# EAGLE schematic Serial I2C Bridge Prop (EAGLE 6.1)
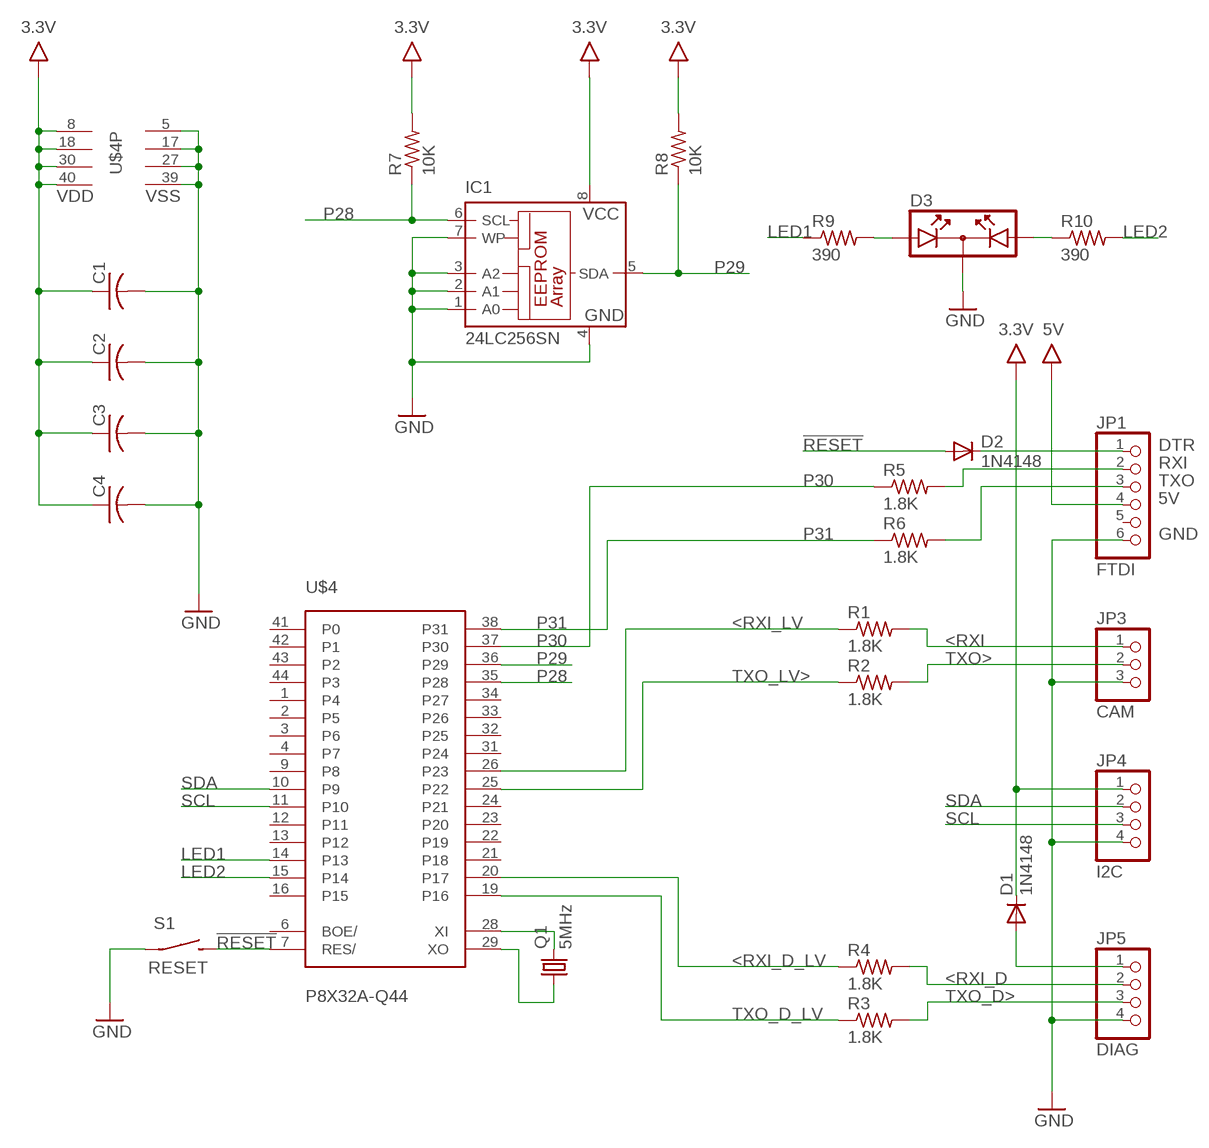
[diagram p0: schematic, sheet 1]

## Parts
C1  C-USC0603  [C0603]
C2  C-USC0603  [C0603]
C3  C-USC0603  [C0603]
C4  C-USC0603  [C0603]
D1  1N4148  1N4148DO35-7  [DO35-7]
D2  1N4148  1N4148DO35-7  [DO35-7]
D3  DUOLED  [DUOLED]
IC1  24LC256SN  [SO-08]
JP1  FTDI  PINHD-1X06_2.54  [1X06]
JP3  CAM  PINHD-1X03_2.54  [1X03]
JP4  I2C  PINHD-1X04_2.54  [1X04]
JP5  DIAG  PINHD-1X04_2.54  [1X04]
Q1  5MHz  CRYSTALHC49S  [HC49/S]
R1  1.8K  R-US_0204/5  [0204/5]
R2  1.8K  R-US_0204/5  [0204/5]
R3  1.8K  R-US_0204/5  [0204/5]
R4  1.8K  R-US_0204/5  [0204/5]
R5  1.8K  R-US_0204/5  [0204/5]
R6  1.8K  R-US_0204/5  [0204/5]
R7  10K  R-US_0204/5  [0204/5]
R8  10K  R-US_0204/5  [0204/5]
R9  390  R-US_0204/5  [0204/5]
R10  390  R-US_0204/5  [0204/5]
S1  RESET  SPSTTACTILE2  [6MMTACTILE]
U$4  P8X32A-Q44  [P8X32A-Q44]

## Nets
3.3V: C1.1 C2.1 C3.1 C4.1 D1.C IC1.8(VCC) JP4.1 R7.2 R8.2 U$4.8(VDD) U$4.18(VDD) U$4.30(VDD) U$4.40(VDD)
5V: JP1.4
!RESET: D2.A S1.P$2(S) U$4.7(RES/)
<RXI: JP3.1 R1.2
<RXI_D: JP5.2 R4.2
<RXI_D_LV: R4.1 U$4.20(P17)
<RXI_LV: R1.1 U$4.26(P23)
GND: C1.2 C2.2 C3.2 C4.2 D3.K IC1.1(A0) IC1.2(A1) IC1.3(A2) IC1.4(GND) IC1.7(WP) JP1.6 JP3.3 JP4.4 JP5.4 S1.P$1(P) U$4.5(VSS) U$4.17(VSS) U$4.27(VSS) U$4.39(VSS)
LED1: R9.1 U$4.14(P13)
LED2: R10.2 U$4.15(P14)
N$1: D2.C JP1.1
N$2: Q1.2 U$4.28(XI)
N$3: D1.A JP5.1
N$4: Q1.1 U$4.29(XO)
N$5: JP1.2 R5.2
N$6: JP1.3 R6.2
N$8: D3.A1 R9.2
N$9: D3.A2 R10.1
P28: IC1.6(SCL) R7.1 U$4.35(P28)
P29: IC1.5(SDA) R8.1 U$4.36(P29)
P30: R5.1 U$4.37(P30)
P31: R6.1 U$4.38(P31)
SCL: JP4.3 U$4.11(P10)
SDA: JP4.2 U$4.10(P9)
TXO>: JP3.2 R2.2
TXO_D>: JP5.3 R3.2
TXO_D_LV: R3.1 U$4.19(P16)
TXO_LV>: R2.1 U$4.25(P22)
Unconnected: JP1.5 U$4.1(P4) U$4.2(P5) U$4.3(P6) U$4.4(P7) U$4.6(BOE/) U$4.9(P8) U$4.12(P11) U$4.13(P12) U$4.16(P15) U$4.21(P18) U$4.22(P19) U$4.23(P20) U$4.24(P21) U$4.31(P24) U$4.32(P25) U$4.33(P26) U$4.34(P27) U$4.41(P0) U$4.42(P1) U$4.43(P2) U$4.44(P3)

## Notes on the sheet
- DTR
- RXI
- TXO
- 5V
- GND

## Library data of the parts
C1-C4 = rcl:C-US: CAPACITOR, American symbol
D1 D2 = diode:1N4148: DIODE high speed (Philips)
D3 = special:DUOLED: Duo LED
IC1 = microchip:24*: Serial EEPROM I2C; MF: MICROCHIP; MPN: 24LC256-I/SN; OC_FARNELL: 9757996; OC_NEWARK: 27C9144
JP1 = pinhead-2:PINHD-1X06: PIN HEADER
JP3 = pinhead-2:PINHD-1X03: PIN HEADER
JP4 JP5 = pinhead-2:PINHD-1X04: PIN HEADER
Q1 = mes_crystal:CRYSTAL: CRYSTAL; OC_FARNELL: 1667008; OC_NEWARK: unknown
R1-R10 = rcl:R-US_: RESISTOR, American symbol
S1 = mes_electromech:SPST: SPST SWITCH
U$4 = parallax_propeller:P8X32A-Q44